# Altium project Automatic_Water_Pump_Controller.PrjPcb
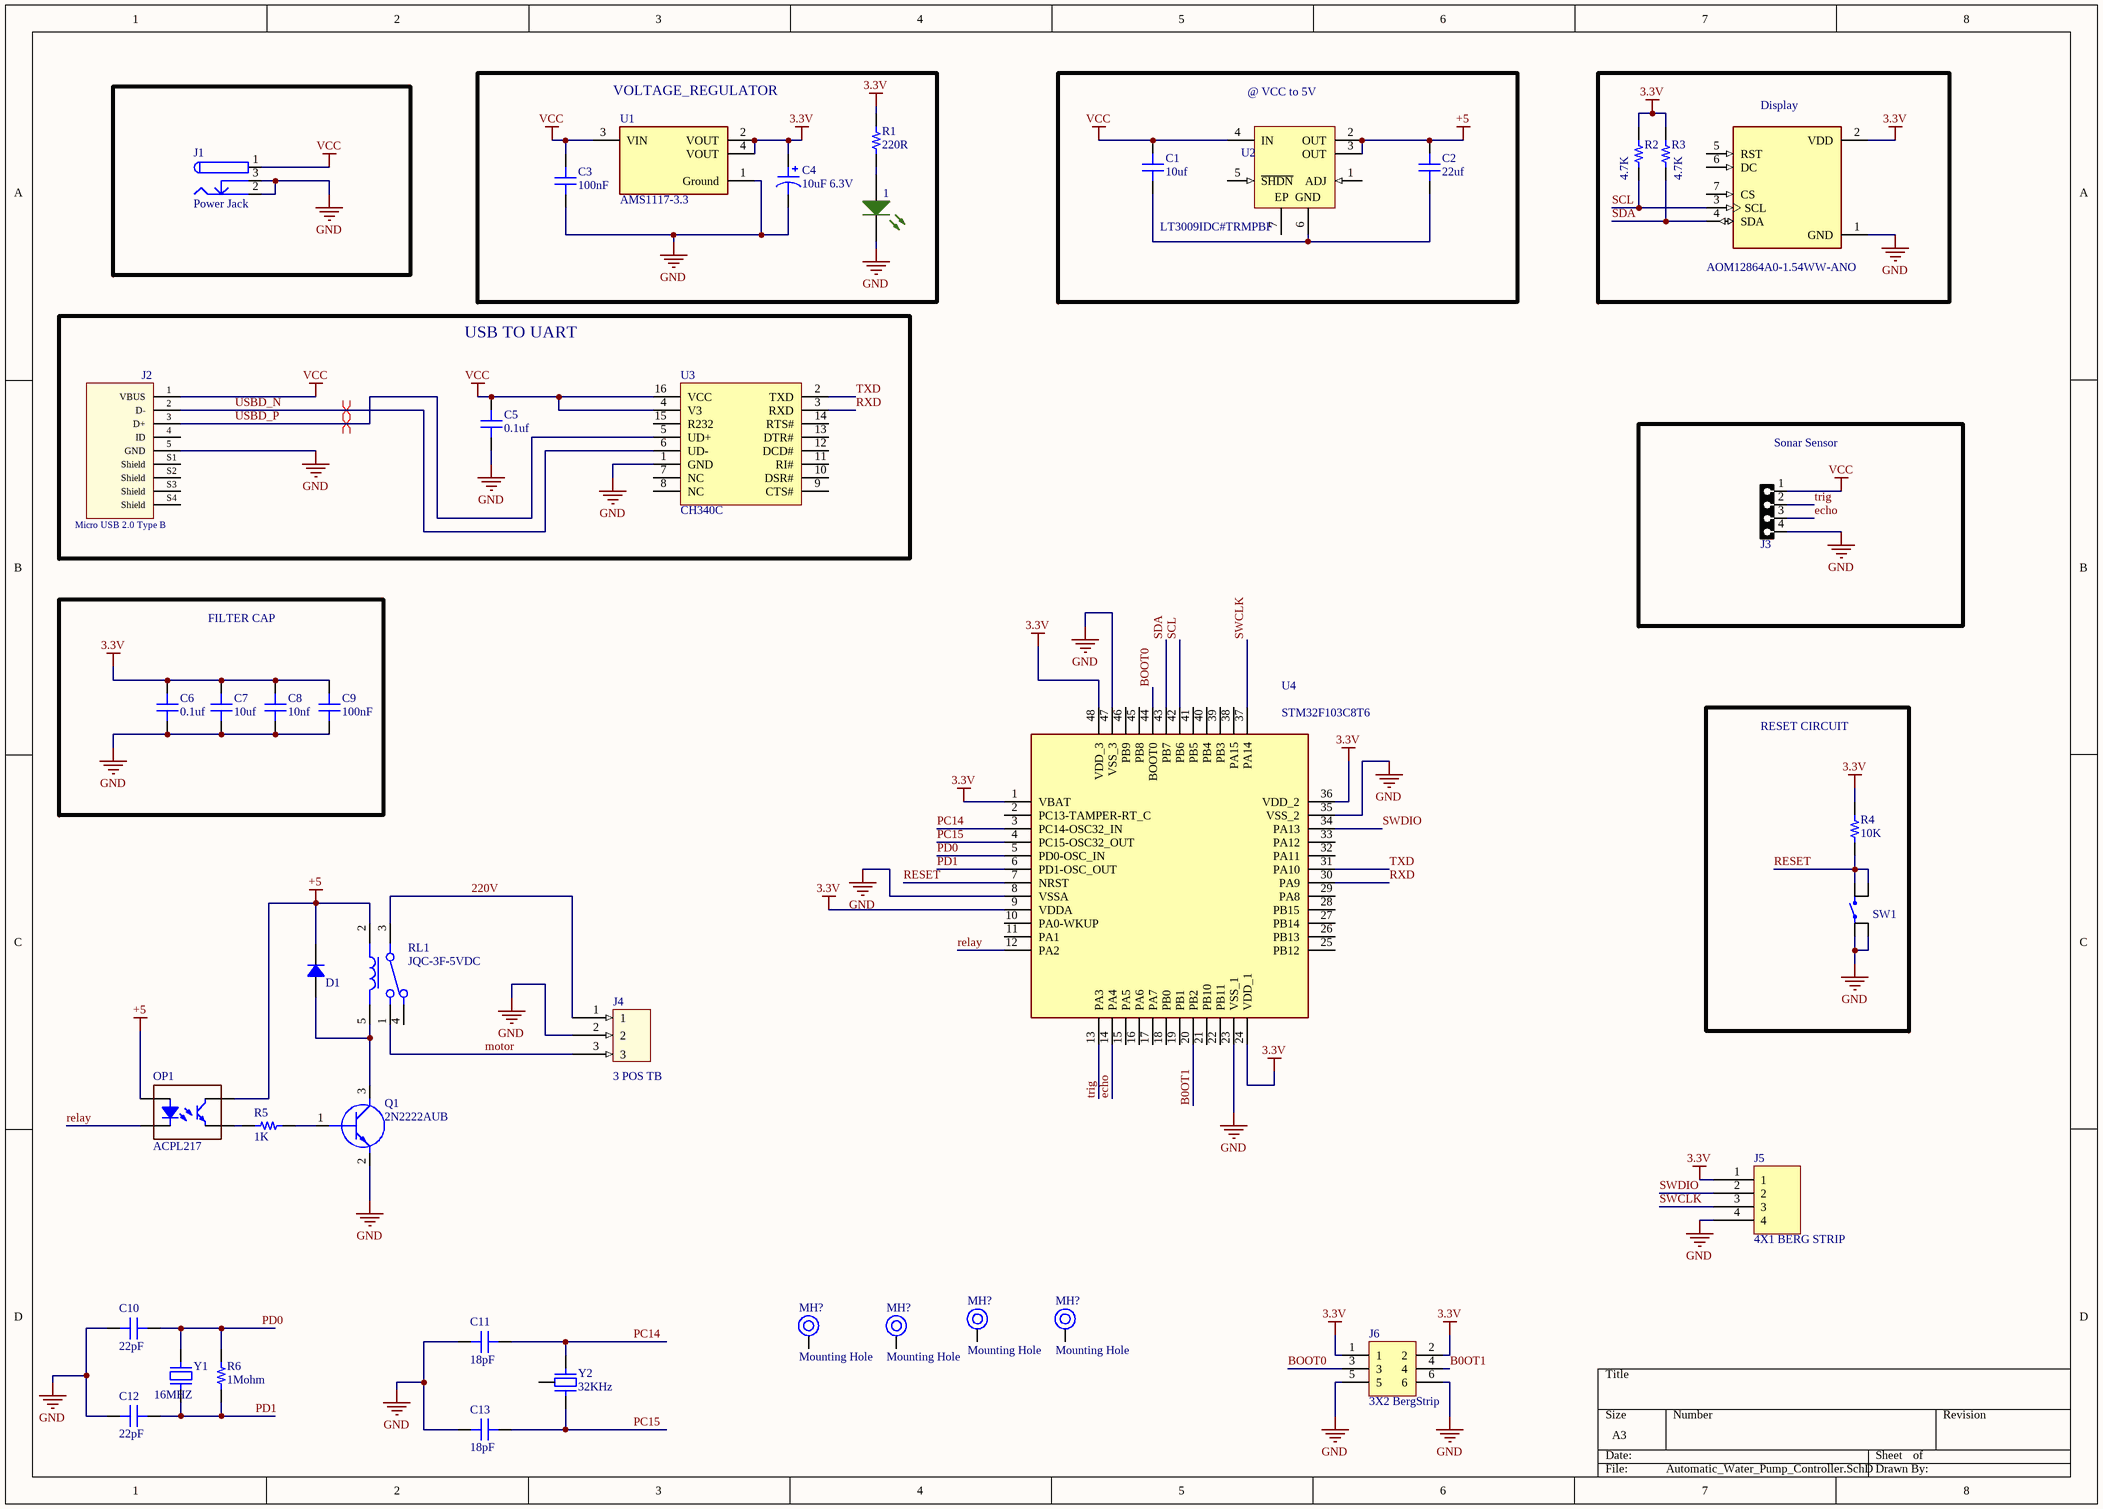
[diagram p0: Automatic_Water_Pump_Controller.SchDoc]
1 sheet, 42 parts. Net scope: global (net labels, ports and power ports of the same name join across sheets).

## Sheet Automatic_Water_Pump_Controller.SchDoc
size A3; SheetNumber: 1; SheetTotal: 1

### Parts
(Parts that share a designator on the sheet are numbered #1, #2 ... from top to bottom, then left to right.)
1  LED SMD 0603 GREEN  [LED_0603_GREEN]  (value not drawn)
C1  10uf  [CAP 0603_1608]
C2  22uf  [CAP 0603_1608]
C3  100nF  [CAP 0805_2012]
C4  10uF 6.3V  [CAP TANSMD 1206_3216 CASE A]
C5  0.1uf  [CAP 0603_1608]
C6  0.1uf  [CAP 0603_1608]
C7  10uf  [CAP 0603_1608]
C8  10nf  [CAP 0603_1608]
C9  100nF  [CAP 0603_1608]
C10  22pF  [CAP 0603_1608]
C11  18pF  [CAP 0603_1608]
C12  22pF  [CAP 0603_1608]
C13  18pF  [CAP 0603_1608]
D1  1N4007  [DO41 P7.5MM]  (value not drawn)
Display  AOM12864A0-1.54WW-ANO  [LCD_AOM12864A0-1.54WW-ANO]
J1  Power Jack  [DC005]
J2  Micro USB 2.0 Type B  [629105150521]
J3  HDRF4  [HDRLP_F_1X4]  (value not drawn)
J4  3 POS TB  [CON3_P196_691101710003_TH_ST]
J5  4X1 BERG STRIP  [CON4_100_40D72_TH_ST_MALE]
J6  3X2 BergStrip  [CON6_100_59D78_TH_ST_Duplicate]
MH?#1  Mounting Hole  [MOUNTING]
MH?#2  Mounting Hole  [MOUNTING]
MH?#3  Mounting Hole  [MOUNTING]
MH?#4  Mounting Hole  [MOUNTING]
OP1  ACPL217  [SOP-4 2.8X4.7MM P1.27MM]
Q1  2N2222AUB  [SOT 23-3]
R1  220R  [RES 0603_1608]
R2  4.7K  [RES 0603_1608]
R3  4.7K  [RES 0603_1608]
R4  10K  [RES 0603_1608]
R5  1K  [RES 0603_1608]
R6  1Mohm  [RES 0603_1608]
RL1  JQC-3F-5VDC  [RLY_JQC_3F_5VDC]
SW1  Tactile 4PIN 6X6mm H4.5mm (SMD)  [SWPBS_SPDT_6X6X5]  (value not drawn)
U1  AMS1117-3.3  [FP-AMS1117-IPC_A]
U2  LT3009IDC#TRMPBF  [LT-DC6-6_V]
U3  CH340C  [SOIC16_50_284_25X90_SMT]
U4  STM32F103C8T6  [LQFP-48_19.6_393_58X11_SMD]
Y1  16MHZ  [HC-49S THT]
Y2  32KHz  [C-002R SMD]

### Blocks framed on the sheet
VOLTAGE_REGULATOR: 1 C3 C4 R1 U1
@ VCC to 5V: C1 C2 U2
USB TO UART: C5 J2 U3
Sonar Sensor: J3
FILTER CAP: C6-C9
RESET CIRCUIT: R4 SW1

### Nets
3.3V: C4.1 C6.2 C7.2 C8.2 C9.2 Display.2(VDD) J5.1 J6.1 J6.2 R1.2 R2.2 R3.2 R4.2 U1.2(VOUT) U1.4(VOUT) U4.1(VBAT) U4.9(VDDA) U4.24(VDD_1) U4.36(VDD_2) U4.48(VDD_3)
+5: C2.2 D1.2 OP1.1 OP1.4 RL1.2 U2.2(OUT) U2.3(OUT)
GND: 1.2(K) C3.2 C4.2 C5.1 C6.1 C7.1 C8.1 C9.1 C10.2 C11.2 C12.2 C13.2 Display.1(GND) J1.2 J1.3 J2.5(GND) J3.4 J4.2 J5.4 J6.5 J6.6 Q1.2(E) SW1.1 SW1.4 U1.1(Ground) U3.1(GND) U4.8(VSSA) U4.23(VSS_1) U4.35(VSS_2) U4.47(VSS_3)
VCC: C1.2 C3.1 C5.2 J1.1 J2.1(VBUS) J3.1 U1.3(VIN) U2.4(IN) U3.4(V3) U3.16(VCC)
220V: J4.1 RL1.3
B0OT1: J6.4 U4.20(PB2)
BOOT0: J6.3 U4.44(BOOT0)
echo: J3.3 U4.14(PA4)
motor: J4.3 RL1.1
PC14: C11.1 U4.3(PC14-OSC32_IN) Y2.1
PC15: C13.1 U4.4(PC15-OSC32_OUT) Y2.2
PD0: C10.1 R6.2 U4.5(PD0-OSC_IN) Y1.2
PD1: C12.1 R6.1 U4.6(PD1-OSC_OUT) Y1.1
relay: OP1.2 U4.12(PA2)
RESET: R4.1 SW1.2 SW1.3 U4.7(NRST)
RXD: U3.3(RXD) U4.30(PA9)
SCL: Display.3(SCL) R2.1 U4.42(PB6)
SDA: Display.4(SDA) R3.1 U4.43(PB7)
SWCLK: J5.3 U4.37(PA14)
SWDIO: J5.2 U4.34(PA13)
trig: J3.2 U4.13(PA3)
TXD: U3.2(TXD) U4.31(PA10)
USBD_N: J2.2(D-) U3.6(UD-)
USBD_P: J2.3(D+) U3.5(UD+)
Net1_1: 1.1(A) R1.1
NetC1_1: C1.1 C2.1 U2.6(GND)
NetD1_1: D1.1 Q1.3(C) RL1.5
NetOP1_3: OP1.3 R5.2
NetQ1_1: Q1.1(B) R5.1

Not connected (* = marked no-connect by the designer): Display 5(RST) 6(DC) 7(CS); J2 4(ID) S1(Shield) S2(Shield) S3(Shield) S4(Shield); MH?#1 1; MH?#2 1; MH?#3 1; MH?#4 1; RL1 4; U2 1(ADJ) 5(~{SHDN}) 7(EP); U3 7(NC) 8(NC) 9(CTS#) 10(DSR#) 11(RI#) 12(DCD#) 13(DTR#) 14(RTS#) 15(R232); U4 2(PC13-TAMPER-RT_C) 10(PA0-WKUP) 11(PA1) 15(PA5) 16(PA6) 17(PA7) 18(PB0) 19(PB1) 21(PB10) 22(PB11) 25(PB12) 26(PB13) 27(PB14) 28(PB15) 29(PA8) 32(PA11) 33(PA12) 38(PA15) 39(PB3) 40(PB4) 41(PB5) 45(PB8) 46(PB9); Y2 3(GND)

### Layout directives
differential pair; differential pair class diff90; rule Clearance Constraint [Clearance = 5mil]; rule Differential Pairs Routing [Pref Gap = 5mil    Min Gap  = 5mil    Max Gap  = 5milPref Width = 8mil    Min Width  = 8mil    Max Width  = 10mil]: USBD_N, USBD_P

### Library data of the parts
C1 C2 C5-C8 = Cap 0603: SMT Capacitor; VALUE: 100nF
C3 = Cap 0805: SMT Capacitor; VALUE: 100nF
C4 = Cap Tan Case A: SMT Tantalum Capacitor; VALUE: 10uF 6.3V
C9-C13 = Cap 0603: SMT Capacitor
  C9: VALUE: 100nF
  C10 C12: VALUE: 22pF
  C11 C13: VALUE: 18pF
D1 = 1N4007 (THD): Diode Standard 1000V 1A Through Hole DO-204AL (DO-41); PartNumber: 1N4007
Display = AOM12864A0-1.54WW-ANO: Non-Touch Graphic LCD Display Module - White OLED SPI 1.54 (39.12mm) 128 x 64; MF: Orient Display; Price: None; Value: *; Package: None; Check_prices: https://www.snapeda.com/parts/AOM12864A0-1.54WW-ANO/Orient+Display/view-part/?ref=eda; SnapEDA_Link: https://www.snapeda.com/parts/AOM12864A0-1.54WW-ANO/Orient+Display/view-part/?ref=snap; Purchase-URL: https://pricing.snapeda.com/search/part/AOM12864A0-1.54WW-ANO/?ref=eda; Availability: In Stock; MP: AOM12864A0-1.54WW-ANO
J1 = Power Jack: PartNumber: DC005-5.5MM
J2 = Micro USB 2.0 Type B Horizontal (SMD) 629105150521: Micro USB 2.0 Type B Horizontal SMT 5 Contacts High Current WR-COM; Rated Current: 3 A; Gender: Female; ComponentLink1Description: Manufacturer; ComponentLink1URL: http://www.we-online.de; ComponentLink2Description: Datasheet; ComponentLink2URL: http://katalog.we-online.de/em/datasheet/629105150521.pdf; PartNumber: 629105150521; Published Date: May 2018; Publisher: Wurth Elektronik; Orientation: Horizontal; Interface Type: Micro USB 2.0 Type B; Operating Temperature: -40 to 85 degC; Mounting Technology: SMT; Packaging: Tape and Reel
J3 = HDRLP_F_1X4: CONN, HEADER, Male, pitch: 2.54mm, 4POS; VALUE: HDRF4
J4 = CON-TB_3X1-196-ST-TH: 3 Pins, 1 Row 5mm Pitch, straight Connector, male; Manufacturer: Wurth Electronics; Manufacturer Part Number: 691101710003; Alternate Part Number-1: NA; Case/Package: TH-CON; Supplier-1: SP ROAD; Supplier Part Number-1: 691101710003
J5 = CON-BS-PLG_4X1-100-ST-TH: 4 Pins, 1 Row 2.54mm Pitch, Straight bergstrip, Male; Manufacturer: NA; Manufacturer Part Number: NA; Case/Package: TH-CON; Supplier-1: SP ROAD; Supplier Part Number-1: NA; Alternate Part Number-1: NA
J6 = CON-BS-PLG_3X2-100-ST-TH: 6 Pins, 2 Row 2.54mm Pitch, Straight bergstrip, Male; Manufacturer: NA; Manufacturer Part Number: NA; Case/Package: TH; Supplier-1: SP ROAD; Supplier Part Number-1: NA; Alternate Part Number-1: NA
MH?#1-MH?#4 = MH_3.5H_6D: Manufacturer Part Number: NA; Case/Package: TH; Manufacturer: NA; Supplier-1: NA; Supplier Part Number-1: NA; Alternate Part Number-1: NA
OP1 = ACPL217: SMD Opto Transistor; PartNumber: ACPL-217-500E
Q1 = TRNS-NPN_50V-800mA-SOT23: Bipolar (BJT) Transistor NPN 50V 800mA 300mW Surface Mount 4-CLCC (3.05x2.415); Manufacturer: Microsemi; Alternate Part Number-1: NA; Manufacturer Part Number: 2N2222AUB; Case/Package: SOT23-3; Supplier-1: Arrow; Supplier Part Number-1: 2N2222AUB
R1-R4 = Res 0603: SMT Resistor; VALUE: 1K
R5 R6 = Res 0603: SMT Resistor
  R5: VALUE: 1K
  R6: VALUE: 1Mohm
RL1 = RLY2_5V-7.5A: 5V DC RELAY 2 CHANNEL; Manufacturer: YUEQING HENGWEI ELECTRONICS; Alternate Part Number-1: NA; Manufacturer Part Number: JQC-3F-5VDC; Case/Package: RLY_JQC-3F-5DC; Supplier-1: SP ROAD; Supplier Part Number-1: JQC-3F-5VDC
SW1 = Tactile 4PIN 6X6mm H4.5mm (SMD): Tactile Switch SPST-NO Top Actuated Surface Mount; PartNumber: PTS645SM43SMTR92 LFS
U1 = CMP-209535-000001-1: LDO Voltage Regulators 1A, 3.3V; Manufacturer: Advanced Monolithic Systems; Dropout Voltage: 1.1V; Output Type: Fixed; Nominal Supply Current: 5mA; Max Power Dissipation: 1.2W; Max Supply Voltage: 15V; Number Of Outputs: 1; Standoff Height: 0.64mm; Max Junction Temp: +125°C; Height: 1.8mm; Package: AMS1117; Device Class L2: Power Management ICs; ComponentLink2Description: Datasheet; ComponentLink2URL: http://www.advanced-monolithic.com/pdf/ds1117.pdf; Category: IC; RoHS: TRUE; Automotive: No; Device Class L1: Integrated Circuits (ICs); Output Current: 1A; Device Class L3: Voltage Regulators - Linear; Temperature: -40°C to +125°C; Output Voltage: 3.3V; Manufacturer Part Number: AMS1117-3.3; Temperature Range Low: -40°C; Octopart: https://octopart.com/ams1117-3.3-advanced+monolithic+systems-25899300; Lead Free: Yes; Ipc Land Pattern Name: SOT229P700X180-4; Temperature Range High: +125°C
U2 = CMP-0476-00005-4: 3 uA IQ, 20 mA Low Dropout Linear Regulator, 1.6 to 20 V Vin, Adjustable Vout, 6-pin SON (DC6-6), -40 to 125 degC, Pb-Free, Mini Tape and Reel; Manufacturer: Linear Technology; Output Voltage: Adj; Vin Min(V): 1.6; Isupply(mA): 0.003; Noise(uV): 150; Dropout Voltage(V): 0.28; Shutdown Current(uA): 1; Vout Min(V): 0.6; Iout(mA): 20; PSRR(dB): 72; Vout Max(V): 19.5; Discrete Pass Element: no; Code_JEDEC: MO-229; Packing: Mini Tape and Reel; ComponentLink2Description: Datasheet; PackageDescription: 6-Pin Plastic DFN, Body 2 x 2 mm, Pitch 0.5 mm; ComponentLink3URL: http://cds.linear.com/docs/en/packaging/DFN_6_05-08-1703.pdf; PackageReference: DC6-6; ComponentLink1URL: http://www.linear.com/; ComponentLink3Description: Package Specification; PackageVersion: Rev. B, 06/2010; ComponentLink2URL: http://cds.linear.com/docs/en/datasheet/3009fd.pdf; Number of Outputs: 1; DatasheetVersion: Rev. D; PartNumber: LT3009IDC#TRMPBF; Mounting Technology: Surface Mount; ComponentLink1Description: Manufacturer URL; Vin Max(V): 20; RoHS: TRUE
U3 = IC_CH340C: USB Bridge, USB to UART USB 2.0 UART Interface; Manufacturer: Olimex; Alternate Part Number-1: NA; Manufacturer Part Number: CH340C; Case/Package: SOIC16; Supplier-1: LCSC; Supplier Part Number-1: C84681
U4 = IC_STM32F103C8T6: ARM® Cortex®-M3 STM32F1 Microcontroller IC 32-Bit 72MHz 64KB (64K x 8) FLASH 48-LQFP (7x7); Manufacturer: STMicroelectronics; Alternate Part Number-1: NA; Manufacturer Part Number: STM32F103C8T6; Case/Package: LQFP48; Supplier-1: LCSC; Supplier Part Number-1: STM32F103C8T6
Y1 = Crystal HC-49S THD: THT Crystal; VALUE: 16MHZ
Y2 = Crystal C-002R SMD: SMT Crystal; VALUE: 32KHz